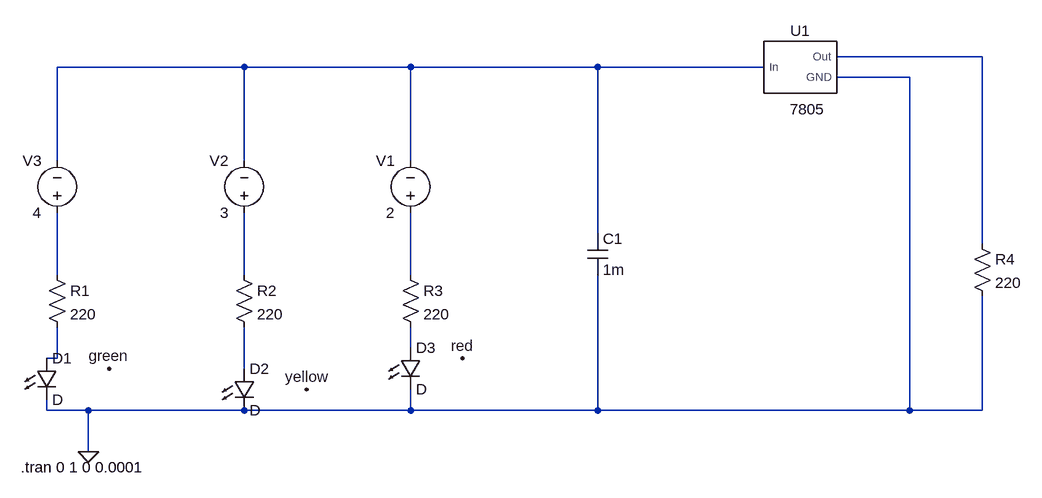
[diagram p0: schematic Draft2.asc]
Draft2.asc, the LTspice schematic file:
Version 4
SHEET 1 1492 680
WIRE 1424 -176 1200 -176
WIRE 288 -160 0 -160
WIRE 544 -160 288 -160
WIRE 832 -160 544 -160
WIRE 1088 -160 832 -160
WIRE 1312 -144 1200 -144
WIRE 0 -16 0 -160
WIRE 288 -16 288 -160
WIRE 544 -16 544 -160
WIRE 832 96 832 -160
WIRE 1424 112 1424 -176
WIRE 0 160 0 64
WIRE 288 160 288 64
WIRE 544 160 544 64
WIRE 544 272 544 240
WIRE 0 288 0 240
WIRE 0 288 -16 288
WIRE 288 304 288 240
WIRE -16 368 -16 352
WIRE 48 368 -16 368
WIRE 288 368 48 368
WIRE 544 368 544 336
WIRE 544 368 288 368
WIRE 832 368 832 160
WIRE 832 368 544 368
WIRE 1312 368 1312 -144
WIRE 1312 368 832 368
WIRE 1424 368 1424 192
WIRE 1424 368 1312 368
WIRE 48 432 48 368
FLAG 48 432 0
FLAG 624 288 red
FLAG 384 336 yellow
FLAG 80 304 green
SYMBOL res -16 144 R0
SYMATTR InstName R1
SYMATTR Value 220
SYMBOL res 272 144 R0
SYMATTR InstName R2
SYMATTR Value 220
SYMBOL LED -32 288 R0
SYMATTR InstName D1
SYMBOL LED 272 304 R0
SYMATTR InstName D2
SYMBOL res 528 144 R0
SYMATTR InstName R3
SYMATTR Value 220
SYMBOL LED 528 272 R0
SYMATTR InstName D3
SYMBOL voltage 544 80 R180
WINDOW 0 24 96 Left 2
WINDOW 3 24 16 Left 2
WINDOW 123 0 0 Left 0
WINDOW 39 0 0 Left 0
SYMATTR InstName V1
SYMATTR Value 2
SYMBOL voltage 288 80 R180
WINDOW 0 24 96 Left 2
WINDOW 3 24 16 Left 2
WINDOW 123 0 0 Left 0
WINDOW 39 0 0 Left 0
SYMATTR InstName V2
SYMATTR Value 3
SYMBOL voltage 0 80 R180
WINDOW 0 24 96 Left 2
WINDOW 3 24 16 Left 2
WINDOW 123 0 0 Left 0
WINDOW 39 0 0 Left 0
SYMATTR InstName V3
SYMATTR Value 4
SYMBOL cap 816 96 R0
SYMATTR InstName C1
SYMATTR Value 1m
SYMBOL 7805 1136 -160 R0
WINDOW 3 19 49 Top 2
SYMATTR InstName U1
SYMBOL res 1408 96 R0
SYMATTR InstName R4
SYMATTR Value 220
TEXT -56 456 Left 2 !.tran 0 1 0 0.0001

The netlist it stands for:
* Draft2.asc
R1 N003 N007 220
R2 N004 N008 220
D1 N007 0 D
D2 N008 0 D
R3 N005 N006 220
D3 N006 0 D
V1 N005 N002 2
V2 N004 N002 3
V3 N003 N002 4
C1 N002 0 1m
XU1 N002 0 N001 7805  ; pins In GND Out
R4 N001 0 220
.model D D
.lib standard.dio
.tran 0 1 0 0.0001
.lib C:\Users\49152\Desktop\HSLH\WS_2022\regulators.lib
.backanno
.end